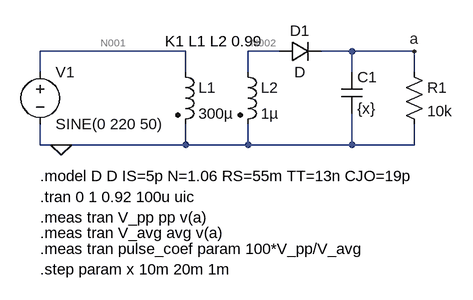
[diagram p0: schematic 1.3.2.asc]
1.3.2.asc, the LTspice schematic file:
Version 4
SHEET 1 880 680
WIRE 320 80 96 80
WIRE 464 80 416 80
WIRE 576 80 528 80
WIRE 672 80 576 80
WIRE 96 112 96 80
WIRE 320 112 320 80
WIRE 416 112 416 80
WIRE 576 112 576 80
WIRE 672 112 672 80
WIRE 96 224 96 192
WIRE 128 224 96 224
WIRE 320 224 320 192
WIRE 320 224 128 224
WIRE 416 224 416 192
WIRE 416 224 320 224
WIRE 576 224 576 176
WIRE 576 224 416 224
WIRE 672 224 672 192
WIRE 672 224 576 224
FLAG 128 224 0
FLAG 672 80 a
SYMBOL voltage 96 96 R0
WINDOW 123 0 0 Left 0
WINDOW 39 0 0 Left 0
SYMATTR InstName V1
SYMATTR Value SINE(0 220 50)
SYMBOL ind2 304 96 R0
SYMATTR InstName L1
SYMATTR Value 300µ
SYMATTR SpiceLine Rser=10m
SYMATTR Type ind
SYMBOL ind2 400 96 R0
SYMATTR InstName L2
SYMATTR Value 1µ
SYMATTR SpiceLine Rser=10m
SYMATTR Type ind
SYMBOL diode 464 96 R270
WINDOW 0 32 32 VTop 2
WINDOW 3 0 32 VBottom 2
SYMATTR InstName D1
SYMBOL cap 560 112 R0
SYMATTR InstName C1
SYMATTR Value {x}
SYMBOL res 656 96 R0
SYMATTR InstName R1
SYMATTR Value 10k
TEXT 96 272 Left 2 !.model D D IS=5p N=1.06 RS=55m TT=13n CJO=19p
TEXT 96 304 Left 2 !.tran 0 1 0.92 100u uic
TEXT 96 336 Left 2 !.meas tran V_pp pp v(a)
TEXT 96 360 Left 2 !.meas tran V_avg avg v(a)
TEXT 96 384 Left 2 !.meas tran pulse_coef param 100*V_pp/V_avg
TEXT 288 64 Left 2 !K1 L1 L2 0.99
TEXT 96 416 Left 2 !.step param x 10m 20m 1m

The netlist it stands for:
* 1.3.2.asc
V1 N001 0 SINE(0 220 50)
L1 N001 0 300µ Rser=10m
L2 N002 0 1µ Rser=10m
D1 N002 a D
C1 a 0 {x}
R1 a 0 10k
.model D D
.lib standard.dio
.model D D IS=5p N=1.06 RS=55m TT=13n CJO=19p
.tran 0 1 0.92 100u uic
.meas tran V_pp pp v(a)
.meas tran V_avg avg v(a)
.meas tran pulse_coef param 100*V_pp/V_avg
K1 L1 L2 0.99
.step param x 10m 20m 1m
.backanno
.end

* Results of the author's LTspice run, read from the files saved beside the schematic
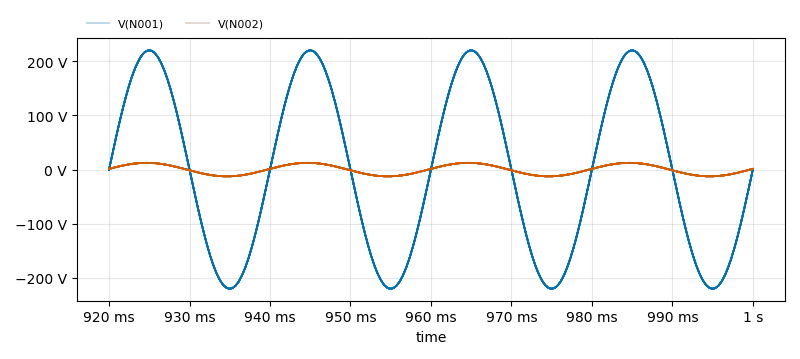
[diagram p1: Transient Analysis of 1.3.2.asc, plotted from the saved traces]
* Transient Analysis, 11 runs:
*   V(N001) [x=0.01]: min -220 V, max 220 V, average 27.22 mV, rms 155.6 V, last 0 V
*   V(N001) [x=0.011]: min -220 V, max 220 V, average 26.69 mV, rms 155.6 V, last 0 V
*   V(N001) [x=0.012]: min -220 V, max 220 V, average 27.89 mV, rms 155.6 V, last 0 V
*   V(N001) [x=0.013]: min -220 V, max 220 V, average 27.05 mV, rms 155.6 V, last 0 V
*   V(N001) [x=0.014]: min -220 V, max 220 V, average 27.16 mV, rms 155.6 V, last 0 V
*   V(N001) [x=0.015]: min -220 V, max 220 V, average 26.67 mV, rms 155.6 V, last 0 V
*   V(N001) [x=0.016]: min -219.9 V, max 220 V, average 27.97 mV, rms 155.6 V, last 0 V
*   V(N001) [x=0.017]: min -220 V, max 220 V, average 27.65 mV, rms 155.6 V, last 0 V
*   V(N002) [x=0.01]: min -12.5 V, max 12.5 V, average 1.663 mV, rms 8.842 V, last 1.319 V
*   V(N002) [x=0.011]: min -12.5 V, max 12.5 V, average 1.628 mV, rms 8.842 V, last 1.319 V
*   V(N002) [x=0.012]: min -12.5 V, max 12.5 V, average 1.694 mV, rms 8.842 V, last 1.319 V
*   V(N002) [x=0.013]: min -12.5 V, max 12.5 V, average 1.65 mV, rms 8.842 V, last 1.319 V
*   V(N002) [x=0.014]: min -12.5 V, max 12.5 V, average 1.671 mV, rms 8.842 V, last 1.319 V
*   V(N002) [x=0.015]: min -12.5 V, max 12.5 V, average 1.641 mV, rms 8.842 V, last 1.319 V
*   V(N002) [x=0.016]: min -12.5 V, max 12.5 V, average 1.727 mV, rms 8.842 V, last 1.319 V
*   V(N002) [x=0.017]: min -12.5 V, max 12.5 V, average 1.698 mV, rms 8.842 V, last 1.319 V
* From the log:
*   Measurement: v_pp
*     step  PP(v(a))  FROM  TO
*        1  0.00269413  0  0.08
*        2  0.00265312  0  0.08
*        3  0.00259018  0  0.08
*        4  0.00257587  0  0.08
*        5  0.00253868  0  0.08
*        6  0.00257587  0  0.08
*        7  0.00257969  0  0.08
*        8  0.00260544  0  0.08
*        9  0.00264072  0  0.08
*       10  0.00271416  0  0.08
*       11  0.00272274  0  0.08
*   Measurement: v_avg
*     step  AVG(v(a))  FROM  TO
*        1  11.8623  0  0.08
*        2  11.8617  0  0.08
*        3  11.8611  0  0.08
*        4  11.8604  0  0.08
*        5  11.8598  0  0.08
*        6  11.859  0  0.08
*        7  11.8583  0  0.08
*        8  11.8575  0  0.08
*        9  11.8566  0  0.08
*       10  11.8556  0  0.08
*       11  11.8549  0  0.08
*   Measurement: pulse_coef
*     step  100*v_pp/v_avg
*        1  0.0227116
*        2  0.0223672
*        3  0.0218376
*        4  0.0217182
*        5  0.0214057
*        6  0.0217209
*        7  0.0217543
*        8  0.021973
*        9  0.0222721
*       10  0.0228934
*       11  0.0229672